# Altium schematic sheet P01_Power.SchDoc
size A4; SheetNumber: 1; SheetTotal: 3
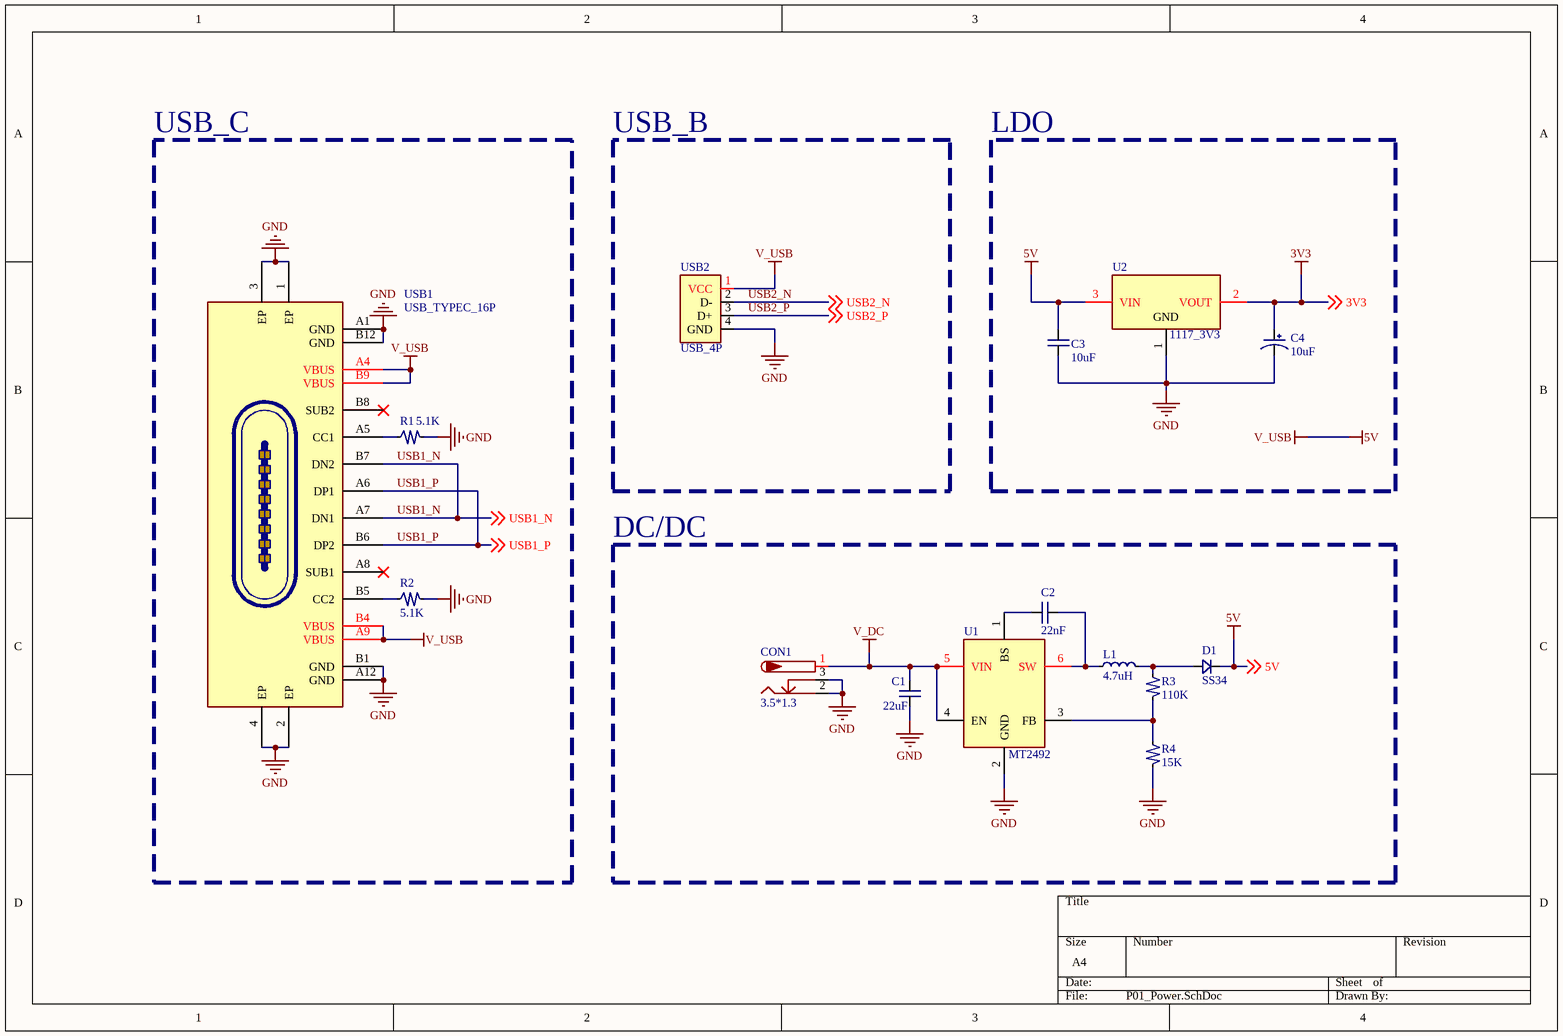
[diagram p0: P01_Power.SchDoc]

## Parts
C1  22uF  [C_0603]
C2  22nF  [C_0603]
C3  10uF  [C_0805]
C4  10uF  [CASE-A-3216]
CON1  3.5*1.3  [DC_Input]
D1  SS34  [SMA]
L1  4.7uH  [L_SMD0420]
R1  5.1K  [R_0402]
R2  5.1K  [R_0402]
R3  110K  [R_0603]
R4  15K  [R_0603]
U1  MT2492  [SOT-23-6]
U2  1117_3V3  [SOT-223]
USB1  USB_TYPEC_16P  [USB_TYPEC_16P]
USB2  USB_4P  [USB_TYPEB_4P]

## Blocks framed on the sheet
USB_C: R1 R2 USB1
USB_B: USB2
LDO: C3 C4 U2
DC/DC: C1 C2 CON1 D1 L1 R3 R4 U1

## Nets
3V3: C4.1 U2.2(VOUT) ; off-sheet 3V3
5V: C3.1 D1.1 U2.3(VIN) USB1.A4(VBUS) USB1.A9(VBUS) USB1.B4(VBUS) USB1.B9(VBUS) USB2.1(VCC) ; off-sheet 5V  [also labelled V_USB]
GND: C1.1 C3.2 C4.2 CON1.2 CON1.3 R1.1 R2.1 R4.1 U1.2(GND) U2.1(GND) USB1.1(EP) USB1.2(EP) USB1.3(EP) USB1.4(EP) USB1.A1(GND) USB1.A12(GND) USB1.B1(GND) USB1.B12(GND) USB2.4(GND)
V_DC: C1.2 CON1.1 U1.4(EN) U1.5(VIN)
USB1_N: USB1.A7(DN1) USB1.B7(DN2) ; off-sheet USB1_N
USB1_P: USB1.A6(DP1) USB1.B6(DP2) ; off-sheet USB1_P
USB2_N: USB2.2(D-) ; off-sheet USB2_N
USB2_P: USB2.3(D+) ; off-sheet USB2_P
NetC2_1: C2.1 U1.1(BS)
NetC2_2: C2.2 L1.2 U1.6(SW)
NetD1_2: D1.2 L1.1 R3.2
NetR1_2: R1.2 USB1.A5(CC1)
NetR2_2: R2.2 USB1.B5(CC2)
NetR3_1: R3.1 R4.2 U1.3(FB)

Not connected (* = marked no-connect by the designer): USB1 A8(SUB1)* B8(SUB2)*

## Library data of the parts
C1-C3 = C: 无极性电容
C4 = C_P: 极性电容
CON1 = DC_Input: 低压电源接口
D1 = D: 二极管
L1 = L: 电感
R1-R4 = R: 电阻
U1 = MT2492: 降压DC/DC / https://atta.szlcsc.com/upload/public/pdf/source/20221209/5C81DA9662873D3A116170FFBF63E49D.pdf
U2 = 1117_3V3: LDO to 3V3
USB1 = USB_TYPEC_16P: USB母座，TYPEC，16P
USB2 = USB_4Pin: USB母座, 4P